# EAGLE design ncp1402-breakout (EAGLE 6.1)
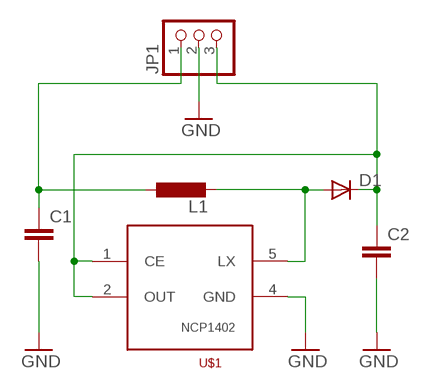
[diagram p0: schematic, sheet 1]

## Parts
C1  C-EUC1210  [C1210]
C2  C-EUC1210  [C1210]
D1  DIODE-SOD80C  [SOD80C]
JP1  PINHD-1X3  [1X03]
L1  L-EUL1812  [L1812]
U$1  NCP1402-SOT23-5  [SOT23-5]

## Nets
GND: C1.2 C2.2 JP1.2 U$1.4(GND)
N$1: C2.1 D1.C JP1.3 U$1.1(CE) U$1.2(OUT)
N$2: D1.A L1.2 U$1.5(LX)
N$3: C1.1 JP1.1 L1.1

## Library data of the parts
C1 C2 = rcl:C-EU: CAPACITOR, European symbol
D1 = diode:DIODE-: DIODE
JP1 = pinhead:PINHD-1X3: PIN HEADER
L1 = rcl:L-EU: INDUCTOR, European symbol
U$1 = _MY_OWN_LIB:NCP1402

## Board
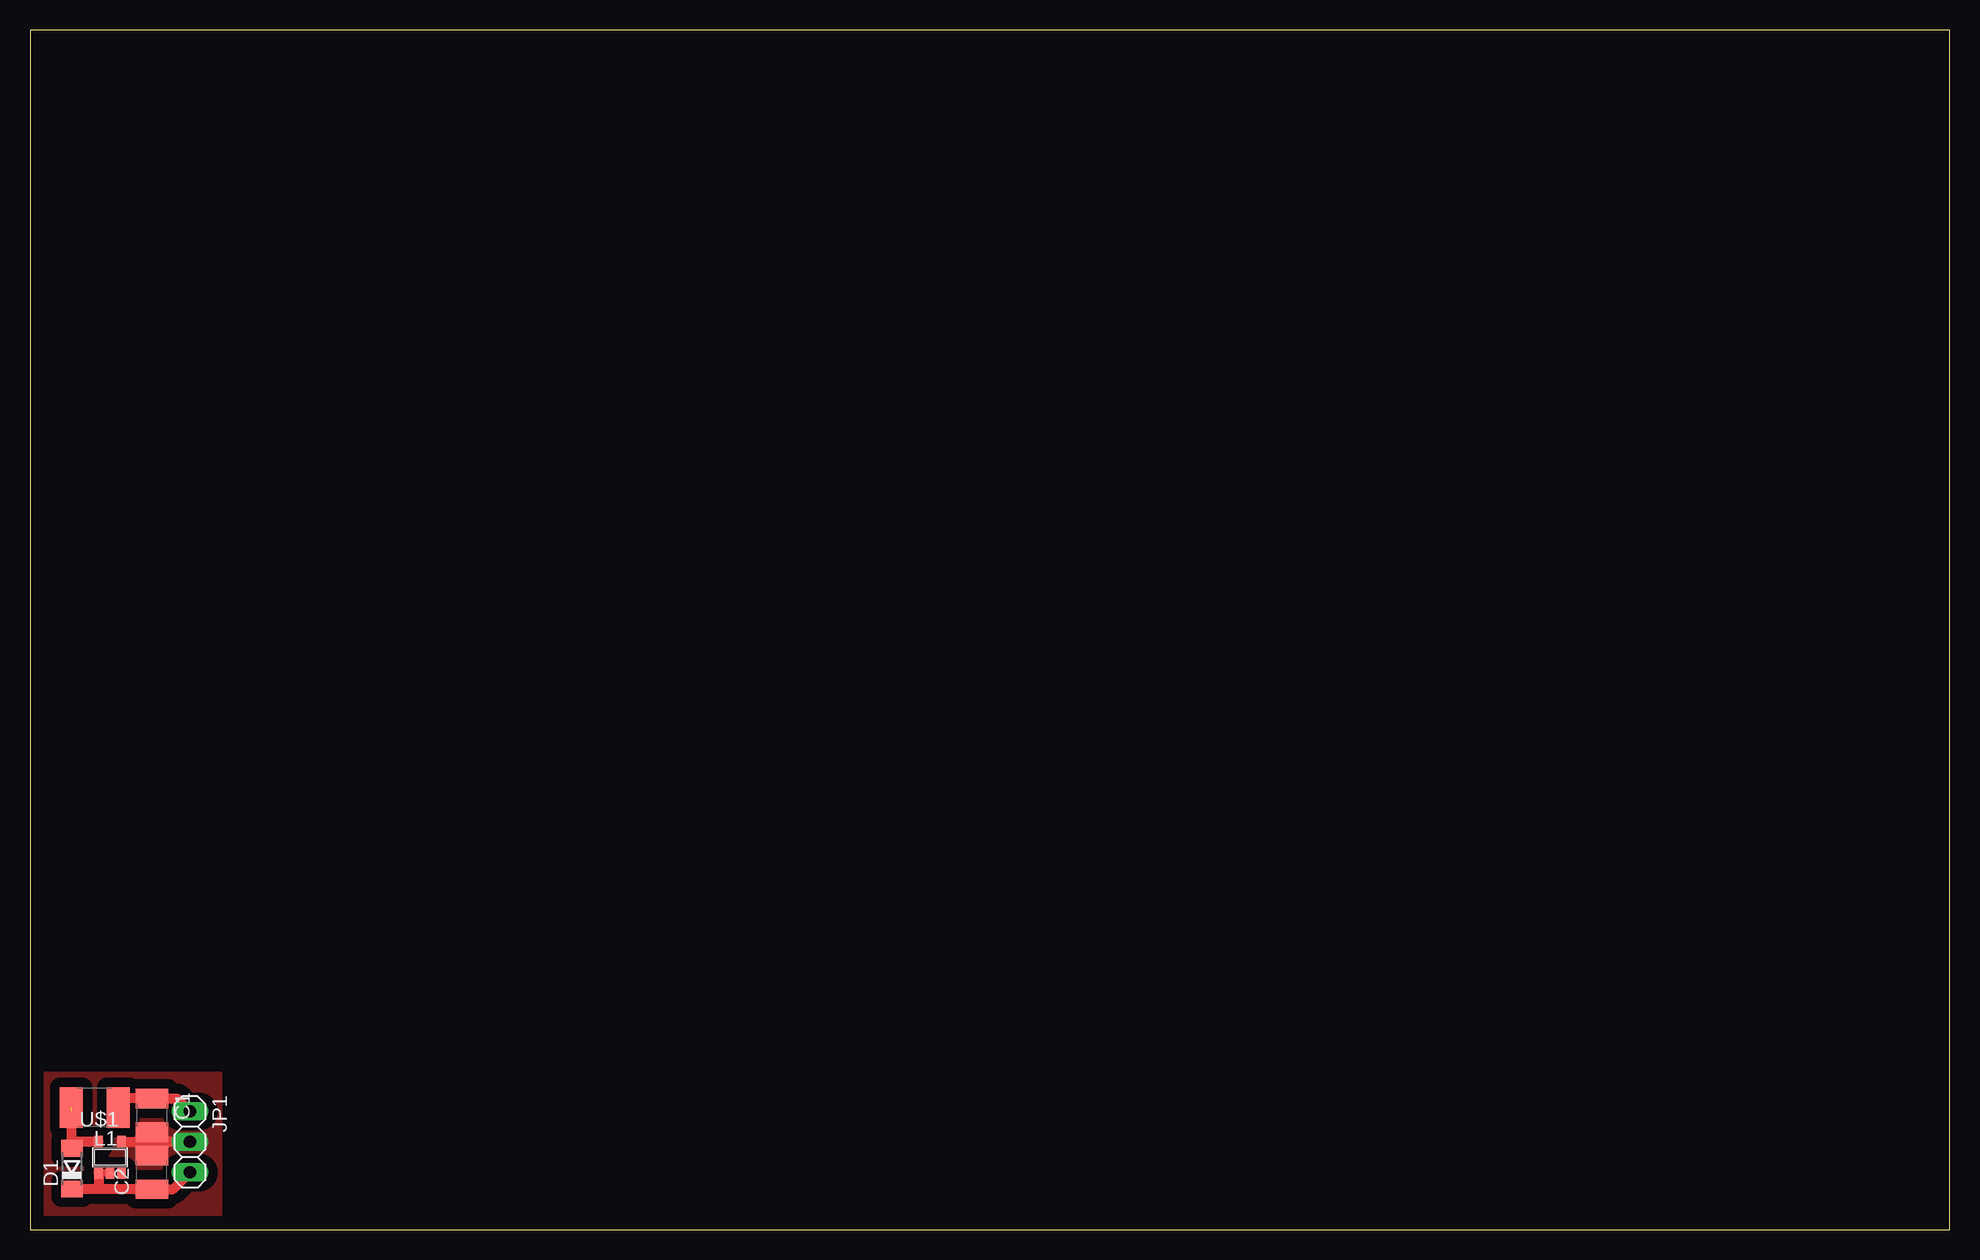
[diagram p1: board, top side]

Size 160 x 100 mm. Coordinates in mm from the lower left corner, seen from the top.
Outline: 0,0 160,0 160,100 0,100 0,0
Copper layers (1*16): Top 0.035mm / dielectric 1.5mm / Bottom 0.035mm
Design rules: minimum track width 10mil, minimum drill 24mil, track to track 12mil, track to pad 12mil, pad to pad 12mil, via to via 12mil, smd to smd 10mil, copper to edge 12mil, drill to drill 12mil, minimum pad ring 10mil, minimum via ring 10mil, stop-mask expansion 4mil, vias tented up to drill 0mil, thermal gap 12mil

### Footprints (pad centres in the part's own frame; a part is rotated, then mirrored left to right if it is on the bottom)
C1210 = smd 1.6 x 2.7: 1 -1.4,0; 2 1.4,0
SOD80C = smd 1.4 x 1.8: A 1.7,0; C -1.7,0
1X03 = drill 1.016 long: 1 -2.54,0; 2 0,0; 3 2.54,0
L1812 = smd 1.9 x 3.4: 1 -1.95,0; 2 1.95,0
SOT23-5 = smd 0.69 x 0.99: 1 -0.95,-1.29; 2 0,-1.29; 3 0.95,-1.29; 4 0.95,1.3; 5 -0.95,1.3

### Placement (x,y rotation side)
C1  10.16,9.53 270 top
C2  10.16,4.76 90 top
D1  3.49,5.08 90 top
JP1  13.34,7.3 270 top
L1  5.4,10.16 180 top
U$1  6.67,6.03 0 top

### Tracks (layer width: path | path; a pad name or v marks a point on that pad's centre or on a via)
GND
  Top 0.61: 13.3,7.33 JP1.2 | 9.21,6.99 10.16,6.99
  Top 0.813: U$1.4 13.3,7.33 | C1.2 10.16,6.99 | 10.16,6.99 C2.2 | JP1.2 11.43,7.3 11.11,6.99 10.16,6.99 | 9.21,6.99 8.89,7.3
  pour Top (isolate 0.813, no thermals): 1.27,1.27 15.88,1.27 15.88,13.02 1.27,13.02
N$1  (1 unrouted)
  Top 0.61: 3.51,3.36 D1.C | 5.72,3.37 5.71,3.36 | U$1.2 5.74,4.74 5.71,4.76
  Top 0.813: 3.51,3.36 5.71,3.36 C2.1 11.94,3.36 JP1.3 | U$1.1 5.72,3.37
N$2  (1 unrouted)
  Top 0.61: 3.73,7.33 D1.A
  Top 0.813: D1.A 3.49,9.84 | U$1.5 3.73,7.33
N$3
  Top 0.61: 7.43,10.93 7.3,10.79 7.3,9.89 L1.1
  Top 0.813: 7.43,10.93 C1.1 12.25,10.93 JP1.1